# EasyEDA Pro project ProPrj_PCB_PCB_Usbhub.epro

# Board PCB_PCB_Usbhub
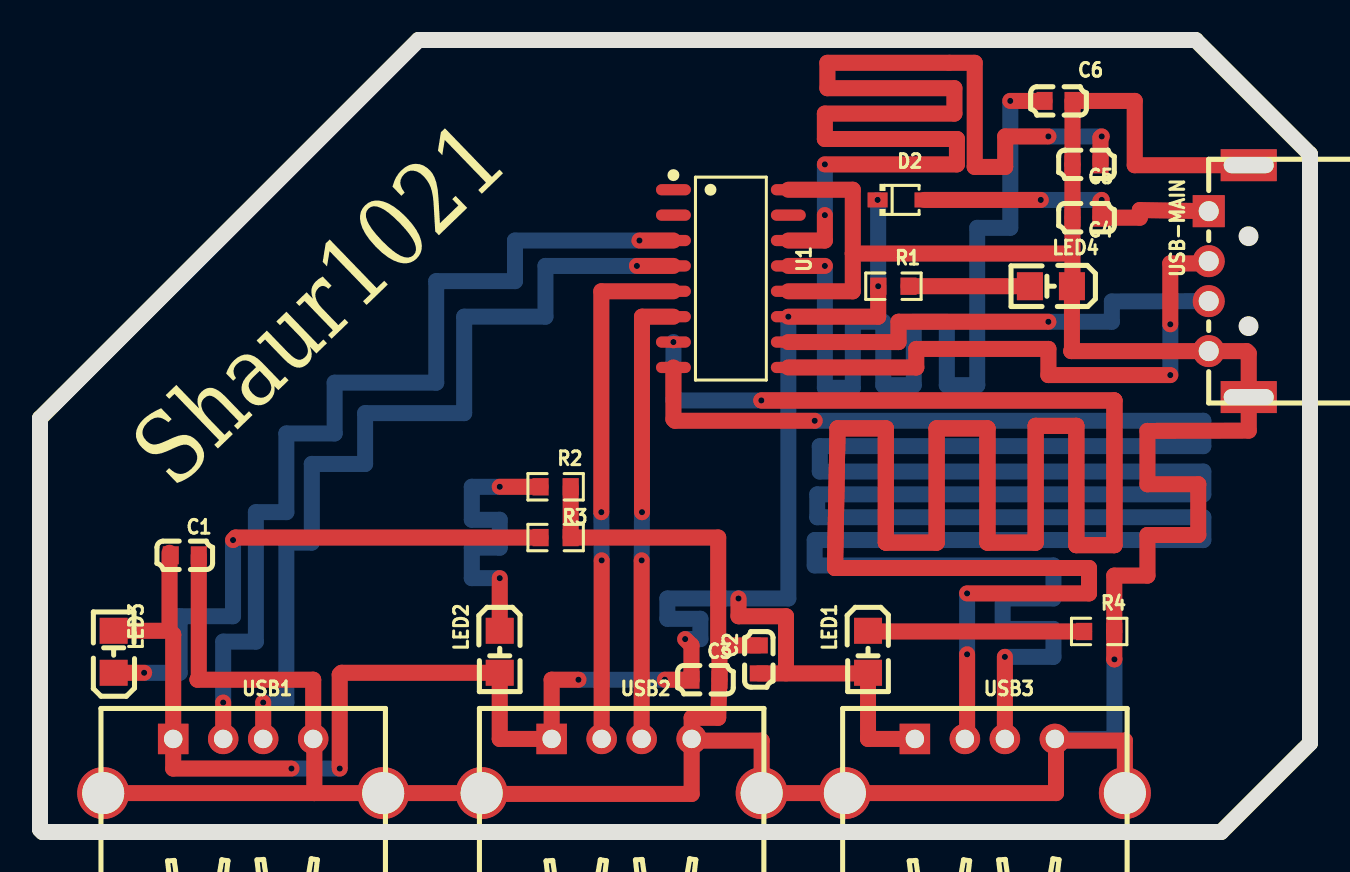
[diagram p0: board, top side]
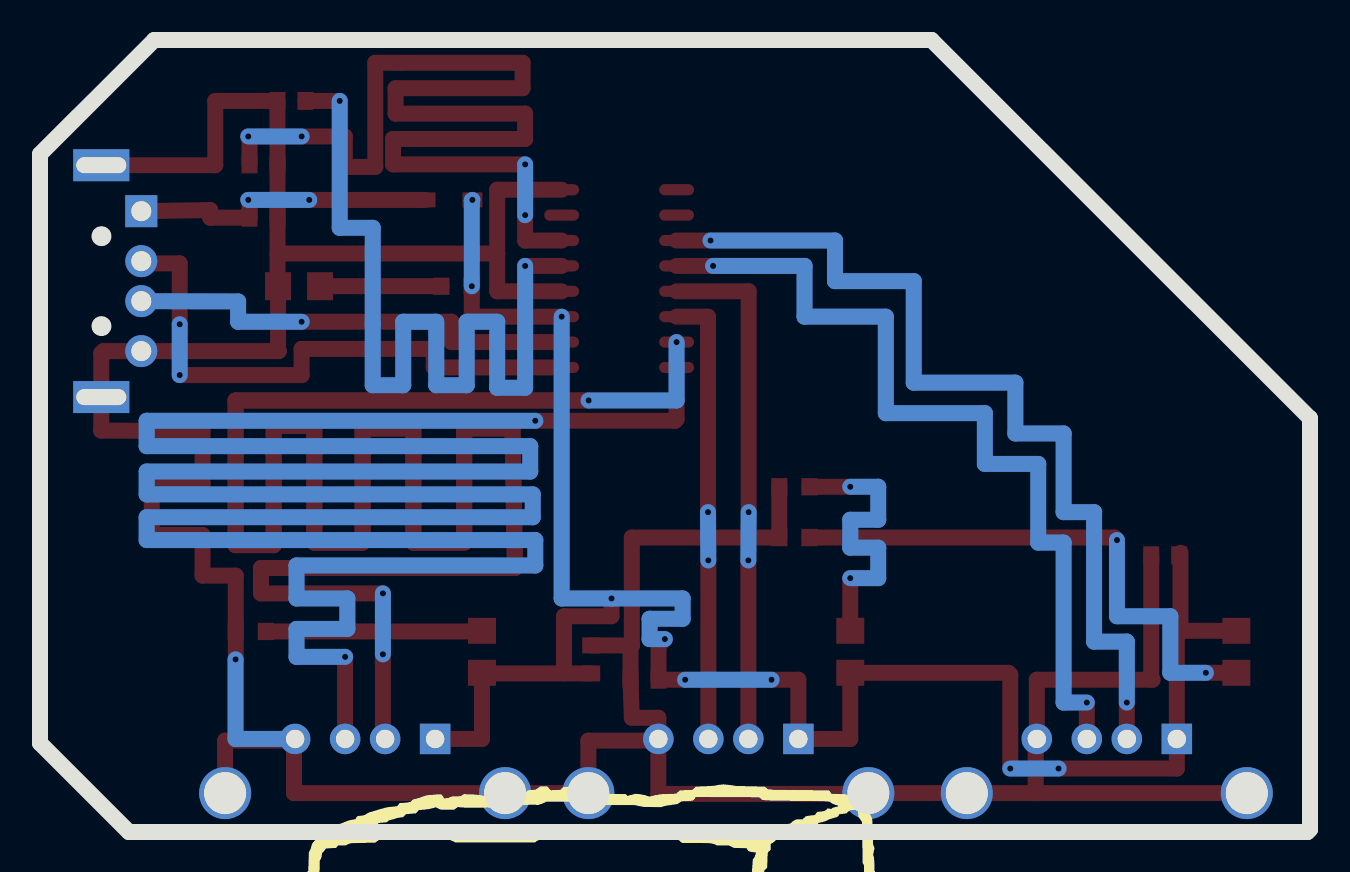
[diagram p1: board, bottom side, seen from below]

Outline 63.5 x 39.62 mm; copper layers: Top Layer, Bottom Layer. Coordinates in mm from the lower left corner of the outline.
Outline path: 0,20.7 0,0.13 0.13,0 59.06,0 63.5,4.44 63.5,33.91 57.78,39.62 18.92,39.62 0,20.7

## Design rules (mm)
via Default (default): diameter min 0.61, default 0.61, max 100.025; hole min 0.305, default 0.305, max 59.995

## Placement (name value [footprint] x y rotation side)
C1  10uF  [C0603]  7.24 13.84 0 top
C2  10uF  [C0603]  35.94 8.64 90 top
C3  10uF  [C0603]  33.27 7.62 0 top
C4  10uF  [C0603]  52.32 30.73 180 top
C5  10uF  [C0603]  52.32 33.4 180 top
C6  10uF  [C0603]  50.93 36.58 0 top
D2  NSR0320MW2T1G  [SOD-323_L1.8-W1.3-LS2.5-RD]  43.05 31.62 0 top
LED1  YLED0805G  [LED0805-FD-GREEN]  41.4 9.02 90 top
LED2  YLED0805G  [LED0805-FD-GREEN]  22.99 9.02 90 top
LED3  YLED0805G  [LED0805-FD-GREEN]  3.68 9.02 270 top
LED4  YLED0805G  [LED0805-FD-GREEN]  50.55 27.3 0 top
R1  47Ω  [R0603]  42.67 27.3 0 top
R2  47Ω  [R0603]  25.78 17.27 0 top
R3  47Ω  [R0603]  25.78 14.73 0 top
R4  47Ω  [R0603]  52.96 10.03 0 top
U1  SL2.1A  [SOP-16_L10.0-W3.9-P1.27-LS6.0-BL]  34.54 27.69 270 top
USB1  USB-AF-90-14.4X13.6-H7.0-DIP  [USB-A-TH_C46407]  10.16 3.3 0 top
USB2  USB-AF-90-14.4X13.6-H7.0-DIP  [USB-A-TH_C46407]  29.08 3.3 0 top
USB3  USB-AF-90-14.4X13.6-H7.0-DIP  [USB-A-TH_C46407]  47.24 3.3 0 top
USB-MAIN  U-G-04DD-W-01  [USB-A-TH_U-G-04WD-W-01]  59.44 27.56 90 top

## Footprints (pads in the part's own frame, mm; a bottom-side part is the same pattern mirrored in y, then rotated)
C0603
  rect 0.8x0.9 smd: 1(-0.7,0) 2(0.7,0)
LED0805-FD-GREEN
  rect 1.3x1.399 smd: 1(-1.05,0) 2(1.05,0)
R0603
  rect 0.806x0.864 smd: 1(-0.753,0) 2(0.753,0)
SOD-323_L1.8-W1.3-LS2.5-RD
  rect 1x0.75 smd: 1(-1.173,0) 2(1.173,0)
SOP-16_L10.0-W3.9-P1.27-LS6.0-BL
  oval 0.56x1.745 smd: 1(-4.445,-2.873) 2(-3.175,-2.873) 3(-1.905,-2.873) 4(-0.635,-2.873) 5(0.635,-2.873) 6(1.905,-2.873) 7(3.175,-2.873) 8(4.445,-2.873) 9(4.445,2.873) 10(3.175,2.873) 11(1.905,2.873) 12(0.635,2.873) 13(-0.635,2.873) 14(-1.905,2.873) 15(-3.175,2.873) 16(-4.445,2.873)
USB-A-TH_C46407
  rect 1.524x1.524 hole 0.92: 1(-3.5,1.355)
  round 1.524 hole 0.92: 2(-1,1.355) 3(1,1.355) 4(3.5,1.355)
  round 2.6 hole 2.1: 5(7,-1.355) 6(-7,-1.355)
USB-A-TH_U-G-04WD-W-01
  rect 1.6x1.6 hole 1: 1(3.5,1)
  round 1.6 hole 1: 2(1,1) 3(-1,1) 4(-3.5,1)
  rect 1.6x2.8 hole 0.8x2.5: 5(5.8,-1) 6(-5.8,-1)

## Nets
+5V: C1.1 C2.1 C3.1 D2.1 LED1.1 LED2.1 LED3.1 R1.1 U1.11 USB1.1 USB2.1 USB3.1
GND: C1.2 C2.2 C3.2 C4.2 C5.2 C6.2 LED4.2 R2.2 R3.2 R4.2 U1.12 U1.16 USB1.4 USB1.5 USB1.6 USB2.4 USB2.5 USB2.6 USB3.4 USB3.5 USB3.6 USB-MAIN.4 USB-MAIN.5 USB-MAIN.6
LED1_2: LED1.2 R4.1
LED2_2: LED2.2 R2.1
R1_2: LED4.1 R1.2
R3_1: LED3.2 R3.1
U1_3: U1.3 USB1.2
U1_4: U1.4 USB1.3
U1_13: C6.1 U1.13
U1_14: C5.1 U1.14
USB2_2: U1.5 USB2.2
USB2_3: U1.6 USB2.3
USB3_2: U1.7 USB3.2
USB3_3: U1.8 USB3.3
USB-MAIN_1: C4.1 D2.2 USB-MAIN.1
USB-MAIN_2: U1.9 USB-MAIN.2
USB-MAIN_3: U1.10 USB-MAIN.3

Pads without a net: U1 1 2 15

## Via types
v1: diameter 0.62, hole 0.31, Top Layer to Bottom Layer, 39 vias

## Routing (per net, layer and track width the routed paths; a pad name or vN(x,y) marks a point on that pad's centre or on a via; arc(x,y) is an arc through that point)
+5V: length 104.9
  Top Layer w0.8: v1(34.93,11.68) 34.93,10.8 37.3,10.8 37.3,7.94 ; v1(12.57,3.17) 6.66,3.17 USB1.1 6.66,9.88 6.48,10.07 ; C2.1 41.37,7.94 LED1.1 41.4,4.66 USB3.1 ; v1(37.42,25.78) 41.91,25.78 v1(41.91,27.3) ; 6.48,10.07 6.48,13.97 ; 6.48,10.07 LED3.1 ; v1(26.92,7.62) 25.58,7.62 USB2.1 22.99,4.66 LED2.1 15.08,7.97 14.99,7.87 v1(14.99,3.17) ; v1(32.26,9.65) 32.57,9.34 C3.1 v1(31.24,7.62)
  Bottom Layer w0.8: v1(41.88,31.62) 41.91,31.59 v1(41.91,27.3) ; v1(37.42,25.78) 37.42,11.68 v1(34.93,11.68) 31.37,11.68 31.37,10.67 33.02,10.67 33.02,9.65 v1(32.26,9.65) ; v1(12.57,3.17) v1(14.99,3.17) ; v1(26.92,7.62) v1(31.24,7.62)
GND: length 193.1
  Top Layer w0.8: 40.64,28.94 40.64,32.13 U1.16 ; 40.64,28.94 51.62,28.94 ; 40.64,28.94 40.64,27.05 U1.12 ; 33.91,9.34 33.97,9.27 C3.2 ; 33.91,9.34 C2.2 ; 33.91,9.34 33.91,14.73 R3.2 R2.2 ; v1(53.72,8.64) 53.71,8.64 R4.2 ; 33.97,7.62 33.91,5.72 32.58,5.72 32.58,4.66 ; 13.72,1.95 USB1.5 USB2.6 22.12,1.91 32.58,1.91 USB2.4 32.67,4.57 36.08,4.57 USB2.5 USB3.6 50.8,1.95 50.8,4.6 USB3.4 50.83,4.57 54.24,4.57 USB3.5 ; 13.72,1.95 USB1.6 ; 13.72,1.95 13.72,4.6 USB1.4 13.66,7.62 7.87,7.62 7.94,7.69 C1.2 ; 53.71,10.03 53.71,12.83 55.37,12.83 55.37,14.86 57.91,14.86 57.91,17.4 55.37,17.4 55.37,20.07 60.44,20.08 USB-MAIN.6 60.44,23.95 60.32,24.06 USB-MAIN.4 51.56,24.06 51.6,24.09 LED4.2 51.62,27.33 C4.2 C5.2 51.63,36.58 54.74,36.58 54.74,33.36 USB-MAIN.5
  Bottom Layer w0.8: USB3.4 53.72,4.66 v1(53.72,8.64)
LED1_2: length 10.8
  Top Layer w0.8: R4.1 41.44,10.03 LED1.2
LED2_2: length 14.8
  Top Layer w0.8: R2.1 v1(22.99,17.27) ; v1(22.99,12.7) LED2.2
  Bottom Layer w0.8: v1(22.99,17.27) 21.59,17.27 21.59,15.62 22.99,15.62 22.99,14.22 21.59,14.22 21.59,12.7 v1(22.99,12.7)
R1_2: length 6.1
  Top Layer w0.8: R1.2 LED4.1
R3_1: length 28
  Top Layer w0.8: R3.1 9.78,14.73 v1(9.65,14.61) ; LED3.2 v1(5.21,7.97)
  Bottom Layer w0.8: v1(9.65,14.61) 9.65,10.8 6.98,10.8 6.98,7.97 v1(5.21,7.97)
U1_3: length 47.4
  Top Layer w0.8: v1(29.97,29.59) U1.3 ; USB1.2 v1(9.16,6.48)
  Bottom Layer w0.8: v1(29.97,29.59) 23.75,29.59 23.75,27.56 19.81,27.56 19.81,22.48 14.73,22.48 14.73,19.94 12.32,19.94 12.32,16 10.8,16 10.8,9.52 9.16,9.52 v1(9.16,6.48)
U1_4: length 44.2
  Top Layer w0.8: USB1.3 v1(11.16,6.48) ; v1(29.84,28.32) U1.4
  Bottom Layer w0.8: v1(11.16,6.48) 12.32,6.48 12.32,14.48 13.59,14.48 13.59,18.41 16.26,18.41 16.26,20.95 21.21,20.95 21.21,25.78 25.27,25.78 25.27,28.32 v1(29.84,28.32)
U1_13: length 46
  Top Layer w0.8: v1(48.51,36.58) C6.1 ; U1.13 v1(39.24,28.32)
  Bottom Layer w0.8: v1(48.51,36.58) 48.51,30.23 46.86,30.23 46.86,22.35 45.34,22.35 45.34,25.53 43.69,25.53 43.69,22.35 42.16,22.35 42.16,25.53 40.64,25.53 40.64,22.22 39.24,22.22 v1(39.24,28.32)
U1_14: length 58.6
  Top Layer w0.8: U1.14 39.24,29.59 v1(39.24,30.86) ; v1(50.42,34.8) 48.26,34.8 48.26,33.27 46.74,33.27 46.74,38.48 39.37,38.48 39.37,37.21 45.72,37.21 45.72,35.94 39.24,35.94 39.24,34.67 45.85,34.67 45.85,33.4 v1(39.24,33.4) ; C5.1 53.02,34.74 v1(53.09,34.8)
  Bottom Layer w0.8: v1(39.24,30.86) v1(39.24,33.4) ; v1(50.42,34.8) v1(53.09,34.8)
USB2_2: length 26
  Top Layer w0.8: U1.5 28.07,27.05 v1(28.07,16) ; USB2.2 v1(28.08,13.59)
  Bottom Layer w0.8: v1(28.07,16) 28.08,13.59
USB2_3: length 22.7
  Top Layer w0.8: v1(30.1,16) 30.1,25.78 U1.6 ; USB2.3 v1(30.08,13.59)
  Bottom Layer w0.8: v1(30.1,16) v1(30.08,13.59)
USB3_2: length 184.1
  Top Layer w0.8: 42.29,20.19 39.88,20.19 ; 42.29,20.19 42.29,14.48 ; 42.29,20.19 39.88,20.19 ; 42.29,20.19 42.29,14.48 ; 39.88,20.19 39.75,13.21 ; 39.88,20.19 39.75,13.21 ; 44.83,14.48 42.29,14.48 ; 44.83,14.48 42.29,14.48 ; 44.83,14.48 44.83,20.19 ; 44.83,14.48 44.83,20.19 ; USB3.2 46.35,4.77 v1(46.35,8.89) ; 47.37,14.48 47.37,20.19 ; 47.37,14.48 49.78,14.48 ; 47.37,14.48 47.37,20.19 ; 47.37,14.48 49.78,14.48 ; 47.37,20.19 44.83,20.19 ; 47.37,20.19 44.83,20.19 ; 51.82,20.32 49.78,20.32 ; 51.82,20.32 49.78,20.32 ; 51.82,20.32 51.82,14.35 ; 51.82,20.32 51.82,14.35 ; 49.78,20.32 49.78,14.48 ; 49.78,20.32 49.78,14.48 ; 39.75,13.21 52.45,13.21 52.45,11.94 v1(46.35,11.94) ; 53.72,21.59 53.72,14.35 ; 53.72,21.59 53.72,14.35 ; 53.72,21.59 v1(36.07,21.59) 53.72,21.59 ; 53.72,14.35 51.82,14.35 ; 53.72,14.35 51.82,14.35
  Bottom Layer w0.8: v1(31.67,24.51) 31.67,21.59 v1(36.07,21.59) ; v1(46.35,11.94) v1(46.35,8.89)
USB3_3: length 160.9
  Top Layer w0.8: USB3.3 v1(48.24,8.76) ; U1.8 31.67,20.65 31.75,20.57 v1(38.74,20.57)
  Bottom Layer w0.8: v1(48.24,8.76) 50.67,8.76 50.67,10.16 48.13,10.16 48.13,11.68 50.67,11.68 50.67,13.33 38.74,13.33 38.74,14.61 58.17,14.61 58.17,15.75 38.86,15.75 38.86,16.89 58.17,16.89 58.17,18.03 38.99,18.03 38.99,19.3 58.17,19.3 58.17,20.57 v1(38.74,20.57)
USB-MAIN_1: length 15.6
  Top Layer w0.8: D2.2 v1(50.04,31.62) ; USB-MAIN.1 54.99,31.11 54.99,30.73 C4.1 53.02,31.56 v1(53.09,31.62)
  Bottom Layer w0.8: v1(50.04,31.62) v1(53.09,31.62)
USB-MAIN_2: length 28.9
  Top Layer w0.8: v1(56.52,22.86) 50.42,22.86 50.42,24.17 43.81,24.17 43.81,23.24 U1.9 ; v1(56.52,25.4) 56.52,28.45 58.32,28.45 USB-MAIN.2
  Bottom Layer w0.8: v1(56.52,22.86) v1(56.52,25.4)
USB-MAIN_3: length 23.1
  Top Layer w0.8: v1(50.42,25.53) 42.93,25.53 42.93,24.51 U1.10
  Bottom Layer w0.8: USB-MAIN.3 53.59,26.54 53.59,25.53 v1(50.42,25.53)

## Text on the board
Top Silkscreen Layer: Shaur1021
